# Altium schematic sheet 55. SOC PMIC.SchDoc: PMIC (part 1 of 3)
size 513 x 386 mm; Project: PROC154E2(001)_SK_AM69; Issue: 1.0; RevCode: E3; Page Create Date: March  8, 1995; Variant Name: Core Design; Schematic Page Number: 55; Page Number: 55; Page Size: C; Comment: MISTRAL_TITLEBLK_CSIZE_1; Page Count: 62; Schematic Page Count: 62; Name: PROC154E2 001 SK AM69; DsnPath: C:\Users\danie\Downloads\sprr466c\PROC154E3_RP\PROC154E3_SCH.DSN; SchematicName: SCHEMATIC1; PageName: 55. SOC PMIC; PageSize: C; TopSchematic: True
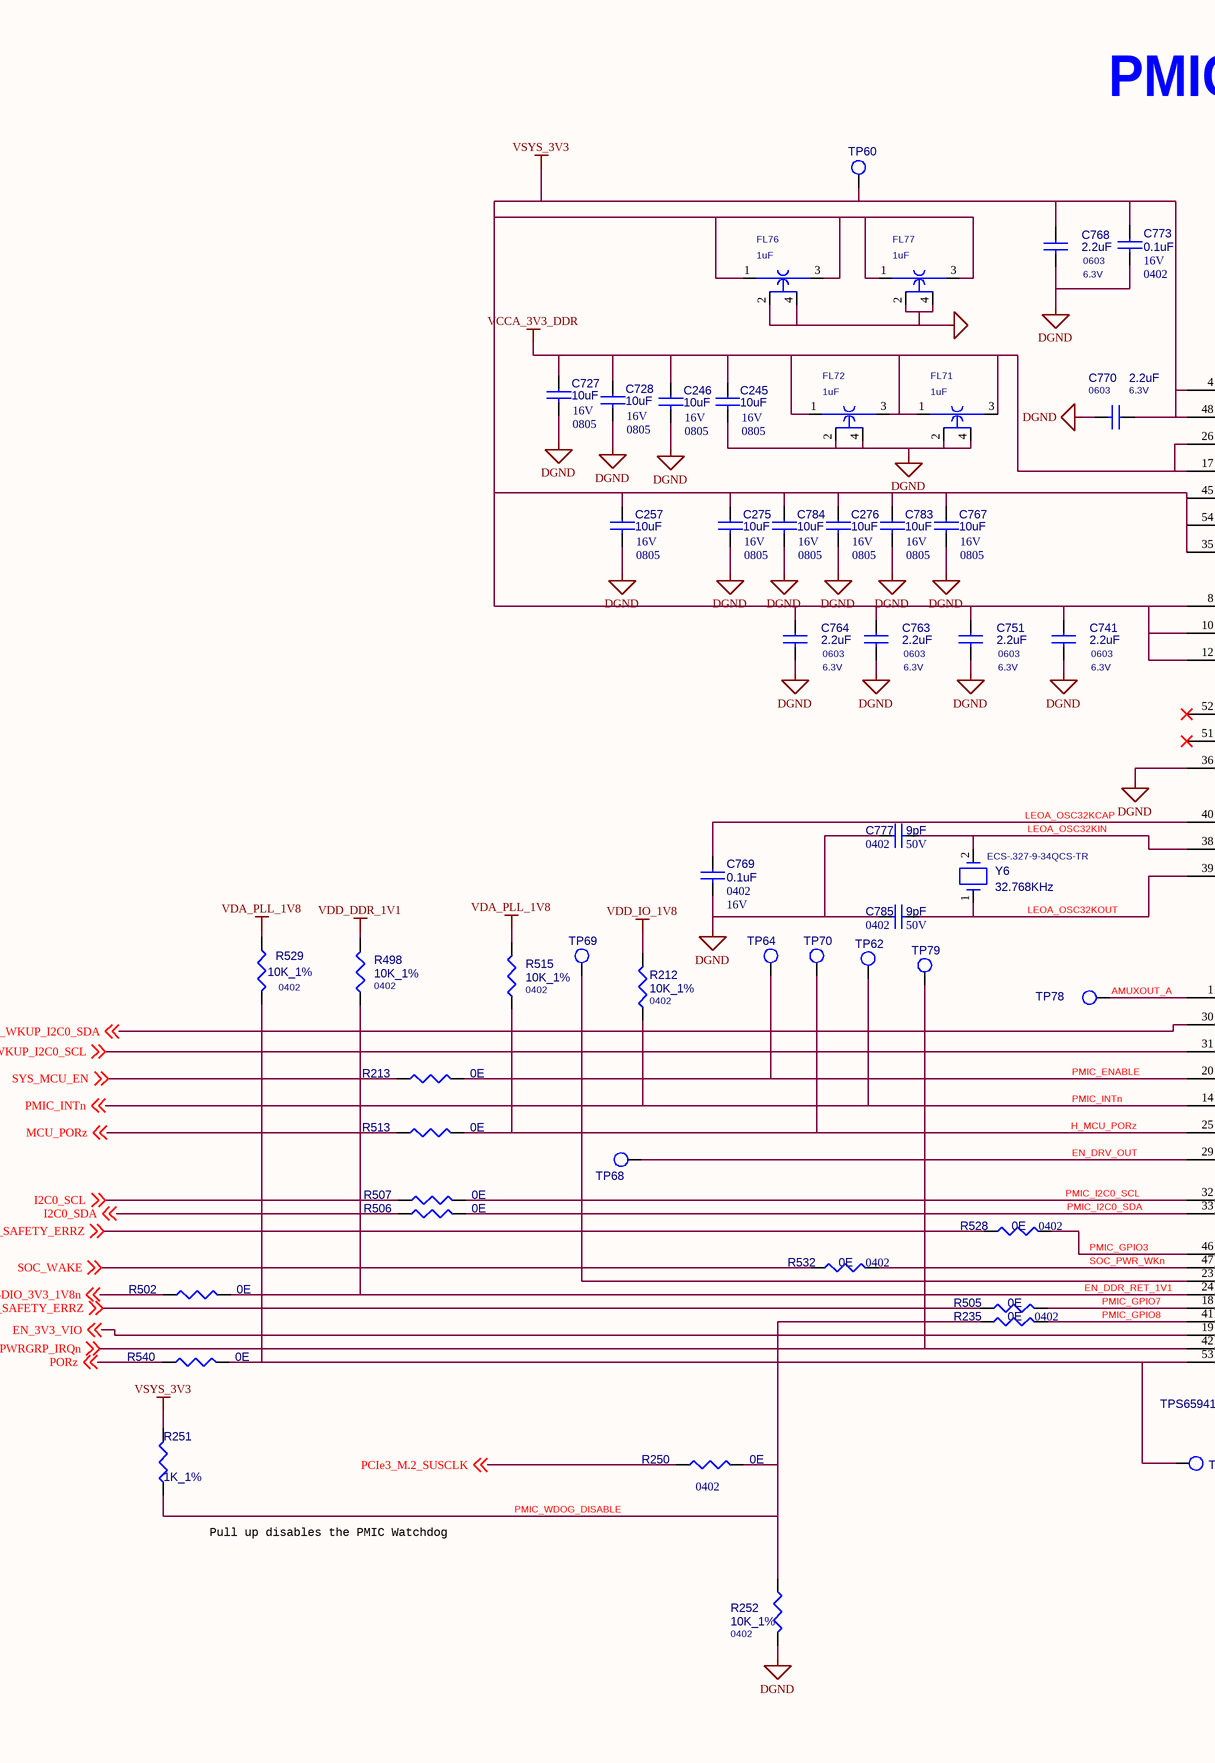
[diagram p0: 55. SOC PMIC.SchDoc, left]
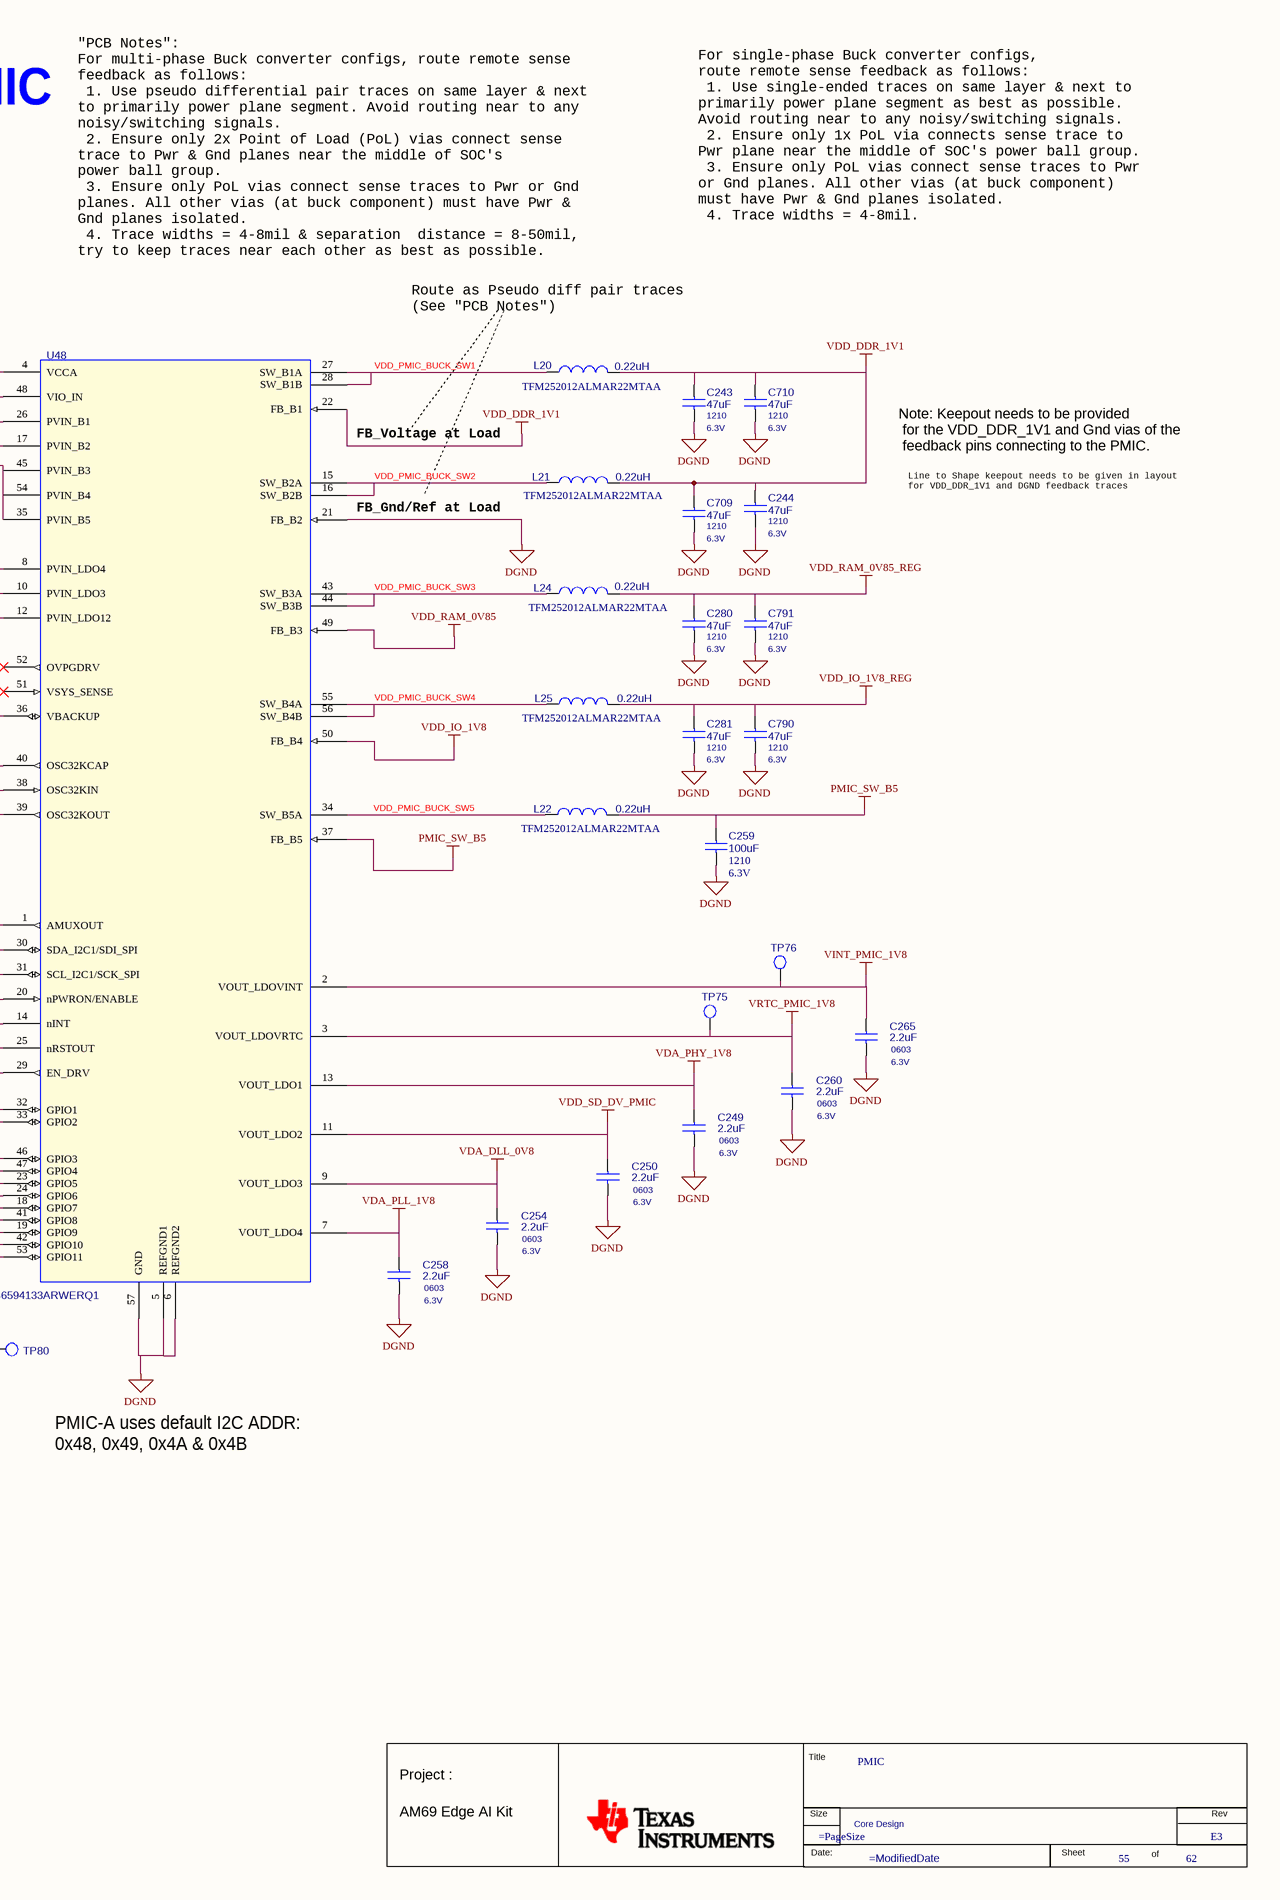
[diagram p1: 55. SOC PMIC.SchDoc, right]

## Parts
*  RevCode: E3  Title: PMIC  Page Number: 55  Page Count: 62  Variant Name: Core Design  (hidden comment: MISTRAL_TITLEBLK_CSIZE_1)  (graphical)
C243  47uF  Voltage: 6.3V  Package: 1210  [CAP1210_2-75]
C244  47uF  Voltage: 6.3V  Package: 1210  [CAP1210_2-75]
C245  10uF  Package: 0805  Voltage: 16V  [CAP0805_1-5]
C246  10uF  Package: 0805  Voltage: 16V  [CAP0805_1-5]
C249  2.2uF  Package: 0603  Voltage: 6.3V  [CAP0603_1]
C250  2.2uF  Package: 0603  Voltage: 6.3V  [CAP0603_1]
C254  2.2uF  Package: 0603  Voltage: 6.3V  [CAP0603_1]
C257  10uF  Package: 0805  Voltage: 16V  [CAP0805_1-5]
C258  2.2uF  Package: 0603  Voltage: 6.3V  [CAP0603_1]
C259  100uF  Package: 1210  Voltage: 6.3V  [CAP1210_2-75]
C260  2.2uF  Package: 0603  Voltage: 6.3V  [CAP0603_1]
C265  2.2uF  Package: 0603  Voltage: 6.3V  [CAP0603_1]
C275  10uF  Package: 0805  Voltage: 16V  [CAP0805_1-5]
C276  10uF  Voltage: 16V  Package: 0805  [CAP0805_1-5]
C280  47uF  Voltage: 6.3V  Package: 1210  [CAP1210_2-75]
C281  47uF  Voltage: 6.3V  Package: 1210  [CAP1210_2-75]
C709  47uF  Package: 1210  Voltage: 6.3V  [CAP1210_2-75]
C710  47uF  Voltage: 6.3V  Package: 1210  [CAP1210_2-75]
C727  10uF  Voltage: 16V  Package: 0805  [CAP0805_1-5]
C728  10uF  Package: 0805  Voltage: 16V  [CAP0805_1-5]
C741  2.2uF  Package: 0603  Voltage: 6.3V  [CAP0603_1]
C751  2.2uF  Voltage: 6.3V  Package: 0603  [CAP0603_1]
C763  2.2uF  Voltage: 6.3V  Package: 0603  [CAP0603_1]
C764  2.2uF  Package: 0603  Voltage: 6.3V  [CAP0603_1]
C767  10uF  Voltage: 16V  Package: 0805  [CAP0805_1-5]
C768  2.2uF  Voltage: 6.3V  Package: 0603  [CAP0603_1]
C769  0.1uF  Voltage: 16V  Package: 0402  [CAP0402_0-75]
C770  2.2uF  Voltage: 6.3V  Package: 0603  [CAP0603_1]
C773  0.1uF  Package: 0402  Voltage: 16V  [CAP0402_0-75]
C777  9pF  Package: 0402  Voltage: 50V  [CAP0402_0-75]
C783  10uF  Package: 0805  Voltage: 16V  [CAP0805_1-5]
C784  10uF  Voltage: 16V  Package: 0805  [CAP0805_1-5]
C785  9pF  Package: 0402  Voltage: 50V  [CAP0402_0-75]
C790  47uF  Voltage: 6.3V  Package: 1210  [CAP1210_2-75]
C791  47uF  Voltage: 6.3V  Package: 1210  [CAP1210_2-75]
FL71  1uF  [EMIFIL_NFM15CC_0402_0-5_TI]
FL72  1uF  [EMIFIL_NFM15CC_0402_0-5_TI]
FL76  1uF  [EMIFIL_NFM15CC_0402_0-5_TI]
FL77  1uF  [EMIFIL_NFM15CC_0402_0-5_TI]
L20  0.22uH  Mfr_part_number: TFM252012ALMAR22MTAA  [IND1008_1-2]
L21  0.22uH  Mfr_part_number: TFM252012ALMAR22MTAA  [IND1008_1-2]
L22  0.22uH  Mfr_part_number: TFM252012ALMAR22MTAA  [IND1008_1-2]
L24  0.22uH  Mfr_part_number: TFM252012ALMAR22MTAA  [IND1008_1-2]
L25  0.22uH  Mfr_part_number: TFM252012ALMAR22MTAA  [IND1008_1-2]
R212  10K_1%  Package: 0402  [RES0402_0-5]
R213  0E  [RES0402_0-5]
R235  0E  Package: 0402  [RES0402_0-5]
R250  0E  Package: 0402  [RES0402_0-5]
R251  1K_1%  [RES0402_0-5]
R252  10K_1%  Package: 0402  [RES0402_0-5]
R498  10K_1%  Package: 0402  [RES0402_0-5]
R502  0E  [RES0402_0-5]
R505  0E  [RES0402_0-5]
R506  0E  [RES0402_0-5]
R507  0E  [RES0402_0-5]
R513  0E  [RES0402_0-5]
R515  10K_1%  Package: 0402  [RES0402_0-5]
R528  0E  Package: 0402  [RES0402_0-5]
R529  10K_1%  Package: 0402  [RES0402_0-5]
R532  0E  Package: 0402  [RES0402_0-5]
R540  0E  [RES0402_0-5]
TP60  TP30_SMD  [TP30_SMD]  (value not drawn)
TP62  TP30_SMD  [TP30_SMD]  (value not drawn)
TP64  TP30_SMD  [TP30_SMD]  (value not drawn)
TP68  TP30_SMD  [TP30_SMD]  (value not drawn)
TP69  TP30_SMD  [TP30_SMD]  (value not drawn)
TP70  TP30_SMD  [TP30_SMD]  (value not drawn)
TP75  TP30_SMD  [TP30_SMD]  (value not drawn)
TP76  TP30_SMD  [TP30_SMD]  (value not drawn)
TP78  TP30_SMD  [TP30_SMD]  (value not drawn)
TP79  TP30_SMD  [TP30_SMD]  (value not drawn)
TP80  TP30_SMD  [TP30_SMD]  (value not drawn)
U48  TPS6594133ARWERQ1  [RVJ0056A]
Y6  32.768KHz  Mfr_part_number: ECS-.327-9-34QCS-TR  [XTAL_ECS-32_130X60_SMD_0-9]

## Nets
DGND: C243.2 C244.2 C245.2 C246.2 C249.2 C250.2 C254.2 C257.2 C258.2 C259.2 C260.2 C265.2 C275.2 C276.2 C280.2 C281.2 C709.2 C710.2 C727.2 C728.2 C741.2 C751.2 C763.2 C764.2 C767.2 C768.2 C769.2 C770.2 C773.2 C777.1 C783.2 C784.2 C785.1 C790.2 C791.2 FL71.2 FL71.4 FL72.2 FL72.4 FL76.2 FL76.4 FL77.2 FL77.4 R252.1 U48.5(REFGND1) U48.6(REFGND2) U48.21(FB_B2) U48.36(VBACKUP) U48.57(GND)
PMIC_SW_B5: C259.1 L22.2 U48.37(FB_B5)
VCCA_3V3_DDR: C245.1 C246.1 C727.1 C728.1 FL71.1 FL71.3 FL72.1 FL72.3 U48.17(PVIN_B2) U48.26(PVIN_B1)
VDA_DLL_0V8: C254.1 U48.9(VOUT_LDO3)
VDA_PHY_1V8: C249.1 U48.13(VOUT_LDO1)
VDA_PLL_1V8: C258.1 R515.2 R529.2 U48.7(VOUT_LDO4)
VDD_DDR_1V1: C243.1 C244.1 C709.1 C710.1 L20.2 L21.2 R498.2 U48.22(FB_B1)
VDD_IO_1V8: R212.2 U48.50(FB_B4)
VDD_IO_1V8_REG: C281.1 C790.1 L25.2
VDD_RAM_0V85: U48.49(FB_B3)
VDD_RAM_0V85_REG: C280.1 C791.1 L24.2
VDD_SD_DV_PMIC: C250.1 U48.11(VOUT_LDO2)
VINT_PMIC_1V8: C265.1 TP76.1(TP) U48.2(VOUT_LDOVINT)
VRTC_PMIC_1V8: C260.1 TP75.1(TP) U48.3(VOUT_LDOVRTC)
VSYS_3V3: C257.1 C275.1 C276.1 C741.1 C751.1 C763.1 C764.1 C767.1 C768.1 C770.1 C773.1 C783.1 C784.1 FL76.1 FL76.3 FL77.1 FL77.3 R251.2 TP60.1(TP) U48.4(VCCA) U48.8(PVIN_LDO4) U48.10(PVIN_LDO3) U48.12(PVIN_LDO12) U48.35(PVIN_B5) U48.45(PVIN_B3) U48.48(VIO_IN) U48.54(PVIN_B4)
AMUXOUT_A: TP78.1(TP) U48.1(AMUXOUT)
EN_3V3_VIO: U48.19(GPIO9) ; off-sheet EN_3V3_VIO
EN_DDR_RET_1V1: R498.1 R502.1 U48.24(GPIO6)
EN_DRV_OUT: TP68.1(TP) U48.29(EN_DRV)
H_MCU_PORz: R513.1 R515.1 TP70.1(TP) U48.25(nRSTOUT)
H_WKUP_I2C0_SCL: U48.31(SCL_I2C1/SCK_SPI) ; off-sheet H_WKUP_I2C0_SCL
H_WKUP_I2C0_SDA: U48.30(SDA_I2C1/SDI_SPI) ; off-sheet H_WKUP_I2C0_SDA
I2C0_SCL: R507.2 ; off-sheet I2C0_SCL
I2C0_SDA: R506.2 ; off-sheet I2C0_SDA
LEOA_OSC32KCAP: C769.1 U48.40(OSC32KCAP)
LEOA_OSC32KIN: C777.2 U48.38(OSC32KIN) Y6.2
LEOA_OSC32KOUT: C785.2 U48.39(OSC32KOUT) Y6.1
MCU_PORz: R513.2 ; off-sheet MCU_PORz
MCU_SAFETY_ERRZ: R505.1 ; off-sheet MCU_SAFETY_ERRZ
PCIe3_M.2_SUSCLK: R250.2 ; off-sheet PCIe3_M.2_SUSCLK
PMIC_ENABLE: R213.1 TP64.1(TP) U48.20(nPWRON/ENABLE)
PMIC_GPIO3: R528.2 U48.46(GPIO3)
PMIC_GPIO7: R505.2 U48.18(GPIO7)
PMIC_GPIO8: R235.2 U48.41(GPIO8)
PMIC_I2C0_SCL: R507.1 U48.32(GPIO1)
PMIC_I2C0_SDA: R506.1 U48.33(GPIO2)
PMIC_INTn: R212.1 TP62.1(TP) U48.14(nINT) ; off-sheet PMIC_INTn
PMIC_WDOG_DISABLE: R235.1 R250.1 R251.1 R252.2
PORz: R540.2 ; off-sheet PORz
SEL_SDIO_3V3_1V8n: R502.2 ; off-sheet SEL_SDIO_3V3_1V8n
SOC_PWR_WKn: R532.2 U48.47(GPIO4)
SOC_PWRGRP_IRQn: TP79.1(TP) U48.42(GPIO10) ; off-sheet SOC_PWRGRP_IRQn
SOC_SAFETY_ERRZ: R528.1 ; off-sheet SOC_SAFETY_ERRZ
SOC_WAKE: R532.1 ; off-sheet SOC_WAKE
SYS_MCU_EN: R213.2 ; off-sheet SYS_MCU_EN
VDD_PMIC_BUCK_SW1: L20.1 U48.27(SW_B1A) U48.28(SW_B1B)
VDD_PMIC_BUCK_SW2: L21.1 U48.15(SW_B2A) U48.16(SW_B2B)
VDD_PMIC_BUCK_SW3: L24.1 U48.43(SW_B3A) U48.44(SW_B3B)
VDD_PMIC_BUCK_SW4: L25.1 U48.55(SW_B4A) U48.56(SW_B4B)
VDD_PMIC_BUCK_SW5: L22.1 U48.34(SW_B5A)
NetR529_1: R529.1 R540.1 TP80.1(TP) U48.53(GPIO11)
NetTP69_1: TP69.1(TP) U48.23(GPIO5)

Not connected (* = marked no-connect by the designer): U48 51(VSYS_SENSE)* 52(OVPGDRV)*

## Notes on the sheet
- "PCB Notes":
  For multi-phase Buck converter configs, route remote sense
  feedback as follows:
  1. Use pseudo differential pair traces on same layer & next
  to primarily power plane segment. Avoid routing near to any
  noisy/switching signals.
  2. Ensure only 2x Point of Load (PoL) vias connect sense
  trace to Pwr & Gnd planes near the middle of SOC's
  power ball group.
  3. Ensure only PoL vias connect sense traces to Pwr or Gnd
  planes. All other vias (at buck component) must have Pwr &
  Gnd planes isolated.
  4. Trace widths = 4-8mil & separation  distance = 8-50mil,
  try to keep traces near each other as best as possible.
- For single-phase Buck converter configs,
  route remote sense feedback as follows:
  1. Use single-ended traces on same layer & next to
  primarily power plane segment as best as possible.
  Avoid routing near to any noisy/switching signals.
  2. Ensure only 1x PoL via connects sense trace to
  Pwr plane near the middle of SOC's power ball group.
  3. Ensure only PoL vias connect sense traces to Pwr
  or Gnd planes. All other vias (at buck component)
  must have Pwr & Gnd planes isolated.
  4. Trace widths = 4-8mil.
- PMIC
- Route as Pseudo diff pair traces
  (See "PCB Notes")
- Note: Keepout needs to be provided
  for the VDD_DDR_1V1 and Gnd vias of the
  feedback pins connecting to the PMIC.
- (near U48) FB_Voltage at Load
- Line to Shape keepout needs to be given in layout
  for VDD_DDR_1V1 and DGND feedback traces
- (near U48) FB_Gnd/Ref at Load
- PMIC-A uses default I2C ADDR:
  0x48, 0x49, 0x4A & 0x4B
- Pull up disables the PMIC Watchdog
- (in symbol MISTRAL_TITLEBLK_CSIZE_1) Title; Project :; Size; Rev; AM69 Edge AI Kit; Date:; Sheet; of